# Altium schematic sheet 4_Sensoren.SchDoc: Schema Sensoren und Diverses
size A4; Organization1: Sciences of Technology Buchs; Size: A4
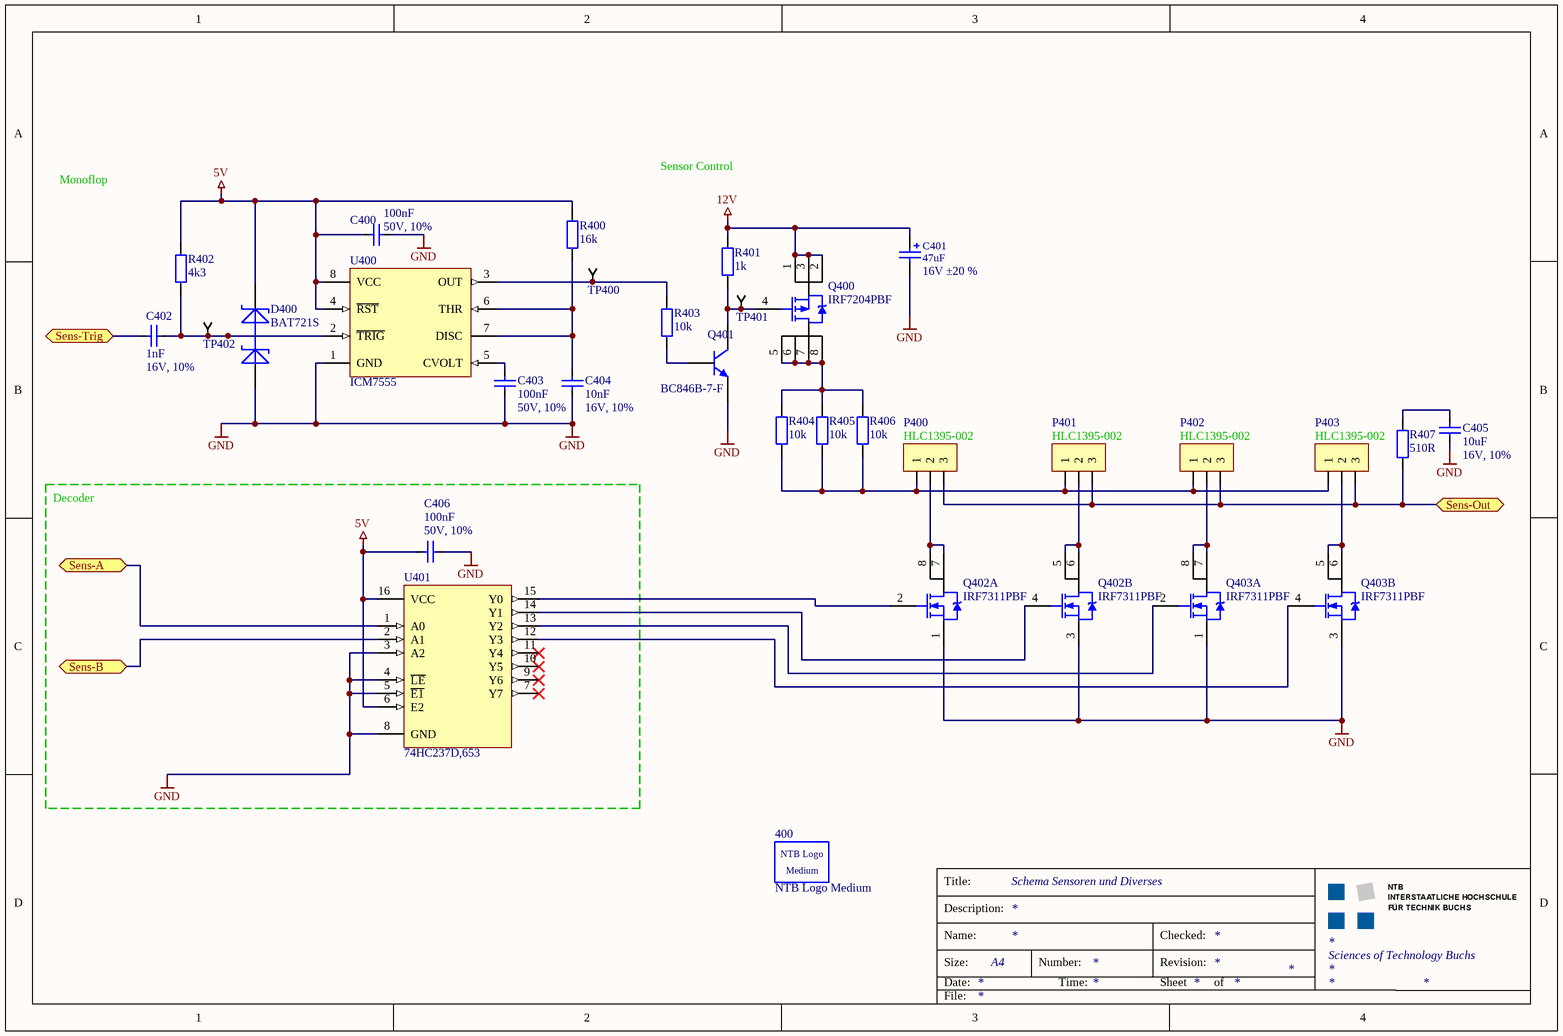
[diagram p0: 4_Sensoren.SchDoc]

## Parts
400  NTB Logo Medium  [NTB Logo Medium]
C400  100nF  ValAddon: 50V, 10%  [CAP-0805[2012]]
C401  value 47uF  ValueAddon: 16V ±20 %  [CDE_CAP AVE CODE D_H]  (hidden comment: AVE476M16D16T-F)
C402  1nF  ValueAddon: 16V, 10%  [CAP-0805[2012]]
C403  100nF  ValAddon: 50V, 10%  [CAP-0805[2012]]
C404  10nF  ValueAddon: 16V, 10%  [CAP-0805[2012]]
C405  10uF  ValAddon: 16V, 10%  [CAP-1206[3216]]
C406  100nF  ValAddon: 50V, 10%  [CAP-0805[2012]]
D400  BAT721S  [SOT-23]
P400  3 Pin Header Buchse  [3PIN HEADER SOCKET 2.54MM]  (value not drawn)
P401  3 Pin Header Buchse  [3PIN HEADER SOCKET 2.54MM]  (value not drawn)
P402  3 Pin Header Buchse  [3PIN HEADER SOCKET 2.54MM]  (value not drawn)
P403  3 Pin Header Buchse  [3PIN HEADER SOCKET 2.54MM]  (value not drawn)
Q400  IRF7204PBF  [SOIC-8]
Q401  BC846B-7-F  [SOT-23]
Q402  IRF7311PBF  [SOIC-8]  (parts A,B of 2)
Q403  IRF7311PBF  [SOIC-8]  (parts A,B of 2)
R400  16k  [RES-0805[2012]]
R401  1k  [RES-0805[2012]]
R402  4k3  [RES-0805[2012]]
R403  10k  [RES-0805[2012]]
R404  10k  [RES-0805[2012]]
R405  10k  [RES-0805[2012]]
R406  10k  [RES-0805[2012]]
R407  510R  [RES-0805[2012]]
TP400  Testpoint SMD 1206  [TP-SMD-1206]  (value not drawn)  (no BOM)
TP401  Testpoint SMD 1206  [TP-SMD-1206]  (value not drawn)  (no BOM)
TP402  Testpoint SMD 1206  [TP-SMD-1206]  (value not drawn)  (no BOM)
U400  ICM7555  [SOIC-8]
U401  74HC237D,653  [SOIC-16]

## Blocks framed on the sheet
Decoder: C406 U401

## Ports
Sens-A, Sens-B, Sens-Out, Sens-Trig

## Nets
5V: C400.1(Pos) C406.1(Pos) D400.2(cathode2) R400.2 R402.2 U400.4(~{RST}) U400.8(VCC) U401.6(E2) U401.16(VCC)
12V: C401.1(Pos) Q400.1(S) Q400.2(S) Q400.3(S) R401.2
GND: C400.2(Neg) C401.2(Neg) C403.2(Neg) C404.2(Neg) C405.2(Neg) C406.2(Neg) D400.1(Anode1) Q401.2(E) Q402.1(S) Q402.3(S) Q403.1(S) Q403.3(S) U400.1(GND) U401.3(A2) U401.4(~{LE}) U401.5(~{E1}) U401.8(GND)
Sens-A: U401.1(A0) ; port Sens-A
Sens-B: U401.2(A1) ; port Sens-B
Sens-Out: P400.3 P401.3 P402.3 P403.3 R407.1 ; port Sens-Out
Sens-Trig: C402.1(Pos) ; port Sens-Trig
NetC402_2: C402.2(Neg) D400.3(Cathode1,_anode2) R402.1 TP402.1 U400.2(~{TRIG})
NetC403_1: C403.1(Pos) U400.5(CVOLT)
NetC404_1: C404.1(Pos) R400.1 U400.6(THR) U400.7(DISC)
NetC405_1: C405.1(Pos) R407.2
NetP400_1: P400.1 P401.1 P402.1 P403.1 R404.1 R405.1 R406.1
NetP400_2: P400.2 Q402.7(D) Q402.8(D)
NetP401_2: P401.2 Q402.5(D) Q402.6(D)
NetP402_2: P402.2 Q403.7(D) Q403.8(D)
NetP403_2: P403.2 Q403.5(D) Q403.6(D)
NetQ400_4: Q400.4(G) Q401.3(C) R401.1 TP401.1
NetQ400_5: Q400.5(D) Q400.6(D) Q400.7(D) Q400.8(D) R404.2 R405.2 R406.2
NetQ401_1: Q401.1(B) R403.2
NetQ402_2: Q402.2(G) U401.15(Y0)
NetQ402_4: Q402.4(G) U401.14(Y1)
NetQ403_2: Q403.2(G) U401.13(Y2)
NetQ403_4: Q403.4(G) U401.12(Y3)
NetR403_1: R403.1 TP400.1 U400.3(OUT)

Not connected (* = marked no-connect by the designer): U401 7(Y7)* 9(Y6)* 10(Y5)* 11(Y4)*

## Notes on the sheet
- Sensor Control
- Monoflop
- HLC1395-002
- (near P401) HLC1395-002
- (near P402) HLC1395-002
- Title:
- Description:
- Size:
- Date:
- Name:
- Number:
- Time:
- Revision:
- Sheet
- Checked:
- of
- File:
- (in symbol NTB Logo Medium) NTB Logo; Medium

## Library data of the parts
C400 C403 C406 = MLCC 0805 100n 50V: 100n 50V X7R MLCC 0805 (1608 Metric); Tolerance: 10%; Case-EIA: 0803; Case-Metric: 2013; Rated Voltage: 50V; Temperature Characteristics EIA: X7R; Temperature Range EIA: -55C/+125C; Value: 100nF
C401 = ELKO 47uF 16V: ELKO, 47uF, 16V, CDE_AVE476M16D16T-F_AVE CODE D; Manufacturer: Cornell Dubilier; #Class: PASSIVE; #ClassSub: CAPACITOR; RefFootprint: CDE_CAP AVE CODE D; Distributor PartNr: 598-AVE476M16D16T-F; Distributor: Mouser; Published: 20121220; Publisher: Stefan Ursella, M.Eng; ComponentLink1Description: Manufacturer Link; ComponentLink2Description: Datasheet; ComponentLink2URL: http://www.cde.com/catalogs/AVE.pdf; ComponentLink3Description: Packaging Specification; Manufacturer PartNr: AVE476M16D16T-F; RefFileFOO: *; RefFileSCH: *; RefSchema: CDE_AVE476M16D16T-F_AVE CODE D; ClassName: Connect_Full
C402 = MLCC 0805 1n 16V: MLCC - SMD/SMT 0805 1000pF 16V C0G 10%; Manufacturer: Vishay; Manufacturer PartNr: VJ0805A102KXJPW1BC; RefFootprint: Gen_0805_H; RefSchema: Cap_1nF; #Class: *; #SubClass: *; Published: 18.12.14; Publisher: SCLM; RefFileFOO: *; RefFileSCH: *; ComponentLink1Description: Manufacturer Link; ComponentLink1URL: http://www.vishay.com/product?docid=28548; ComponentLink2Description: Datasheet; ComponentLink2URL: http://www.vishay.com/docs/28548/vjw1bcbascomseries.pdf; Supplier 1: Mouser; Supplier Part Number 1: 77-VJ0805A102KXJPBC; Status: Lager?; Value: 1nF
C404 = MLCC 0805 10n 16V: 10n 16V X7R MLCC 0805; Manufacturer: AVX; Manufacturer PartNr: 0805YC103KAT2A; #Class: *; #SubClass: *; Published: 09.01.15; Publisher: SCLM; RefFootprint: *; RefFileFOO: *; RefFileSCH: *; RefSchema: *; ComponentLink1Description: Manufacturer Link; ComponentLink1URL: http://www.avx.com/prodinfo_productdetail.asp?I=45&K=search&C=&word=0805YC103KAT2A&form=number&Number=; ComponentLink2Description: Datasheet; ComponentLink2URL: http://www.farnell.com/datasheets/1679506.pdf; Status: LAger?; Value: 10nF
C405 = MLCC 1206 10u 16V: 10u 16V X7R MLCC 1206 (3016 Metric); Rated Voltage: 10V; Tolerance: 10%; Case-EIA: 1206; Case-Metric: 3216; Temperature Characteristics EIA: X7R; Temperature Range EIA: -55C/+125C; Value: 10uF
D400 = BAT721S-SOT23: NXP  BAT721S  SCHOTTKY-DIODE, 2FACH; RefFootprint: CDE_CAP AVE CODE D; RefSchema: CDE_AVE476M16D16T-F_AVE CODE D; ComponentLink1Description: Manufacturer Link; ComponentLink1URL: http://www.nxp.com/search?q=%09bat721s&type=keyword&rows=10; ComponentLink2Description: Datasheet; ComponentLink2URL: http://www.farnell.com/datasheets/453891.pdf; ComponentLink3Description: Packaging Specification; Distributor: Farnell; Distributor PartNr: 1081200; Manufacturer: NXP; Manufacturer PartNr: BAT721S; Published: 20150612; Publisher: SCNP
P400-P403 = 3 Pin Header Buchse: 3 Pin Header 2.54mm Buchse; #Class: *; #SubClass: *; Manufacturer: *; Manufacturer PartNr: *; ComponentLink1Description: Manufacturer Link; ComponentLink1URL: *; ComponentLink2Description: *; ComponentLink2URL: *
Q400 = IRF7204: High Power P-Kanal Mosfet; Manufacturer: International Rectifiers; RefFootprint: IRF_SO8_H; RefSchema: IRF_IRF7204_SO-8; Published: 8-Jun-2000; Publisher: Altium Limited; ComponentLink1Description: Manufacturer Link; ComponentLink1URL: http://www.irf.com/; ComponentLink2Description: Datasheet; ComponentLink2URL: http://www.irf.com/product-info/datasheets/data/irf7204.pdf; Manufacturer PartNr: IRF7204PBF; Supplier Part Number 1: 9103350; Supplier 1: Farnell; RefFileFOO: *; RefFileSCH: *; Status: nLager; #Class: *; #SubClass: *
Q401 = BC846B-SOT23: NPN General-purpose Transistor; Manufacturer: DIODES INC; #Class: SEMICONDUCTOR-TRANSISTOR; #ClassSub: BJT-NPN; RefFootprint: DIODS_SOT23_1B2E3C_3_H; RefSchema: DIODS_BC846B-7-F_SOT23; Published: 17-Sep-2003; Publisher: Altium Limited; ComponentLink1Description: Manufacturer Link; ComponentLink1URL: http://www.diodes.com/products/catalog/detail.php?item-id=6689&popup=datasheet; ComponentLink2Description: Datasheet; ComponentLink2URL: http://www.diodes.com/datasheets/ds11108.pdf; ComponentLink3Description: Packaging Specification; ComponentLink3URL: http://www.diodes.com/datasheets/ap02001.pdf; Distributor: Farnell; Manufacturer PartNr: BC846B-7-F; Distributor PartNr: 1773617; Status: nLager; RefFileFOO: *; RefFileSCH: *
Q402 Q403 = IRF7311: Dual N-Kanal Mosfet; Manufacturer: International Rectifier; RefFootprint: IRF_SO8_H; RefSchema: IRF_IRF7311_SO-8; Published: 8-Jun-2000; Publisher: Altium Limited; ComponentLink1Description: Manufacturer Link; ComponentLink1URL: http://www.irf.com/; ComponentLink2Description: Datasheet; ComponentLink2URL: http://www.irf.com/product-info/datasheets/data/irf7311.pdf; Supplier 1: Farnell; Manufacturer PartNr: IRF7311PBF; Supplier Part Number 1: 1013364; RefFileFOO: *; RefFileSCH: *; #Class: *; #SubClass: *; Status: nLager
R400-R407 = RES 0805: 0805 (2013 Metric) 1/10 W 10K 1 Thick Film Chip Resistor; Power: 1/10 W; Case-EIA: 0805; Case-Metric: 2013; Tolerance: 1%; Temp. Coefficent: ±100ppm; Technology: SMT
  R400: Value: 16k
  R401: Value: 1k
  R402: Value: 4k3
  R403-R406: Value: 10k
  R407: Value: 510R
TP400-TP402 = Testpoint SMD 1206: Testpoint xSmall; Type: Standard (No BOM)
U400 = ICM7555-SOIC8: General purpose CMOS timer; Manufacturer: National Semiconductor; #Class: Analog; #SubClass: Timer Circuit; RefFootprint: NXP_SO8(SOT96-1)_H; RefSchema: NXP_ICM7555_SO-8; Published: 15/04/2002; Publisher: Altium Hobart Technology Centre; ComponentLink1Description: Datasheet; ComponentLink2Description: Distributor; ComponentLink1URL: http://www.datasheetcatalog.org/datasheet/intersil/fn2867.pdf; ComponentLink2URL: https://www.distrelec.ch/ishopWebFront/catalog/product.do/para/node/is/acaaabaaacaf/and/highlightNode/is/640145/and/id/is/01/and/series/is/1.html; Supplier 1: Mouser Electronics; Manufacturer PartNr: ICM7555; Supplier Part Number 1: 771-ICM7555; RefFileFOO: *; RefFileSCH: *; Status: nLager
U401 = 74HC237D-SOIC16: 3-to-8 line decoder, demultiplexer, NXP, SO16; RefFootprint: NXP_SO16(SOT109-1)_H; RefSchema: NXP_74HC237D_SO-16; Supplier 1: Mouser Electronics; Supplier Part Number 1: 771-HC237D653; Manufacturer PartNr: 74HC237D,653; Status: nLager; #Class: *; #SubClass: *; Manufacturer: NXP; Published: 28.11.2014; Publisher: SCLM; RefFileFOO: *; RefFileSCH: *; ComponentLink1Description: Manufacturer Link; ComponentLink1URL: http://www.nxp.com/products/logic/decoders_demultiplexers/74HC237D.html; ComponentLink2Description: Datasheet; ComponentLink2URL: http://www.nxp.com/documents/data_sheet/74HC237.pdf